# EAGLE design Adafruit PiTFT Plus 3.5in (EAGLE 6.6.0)
REV: C
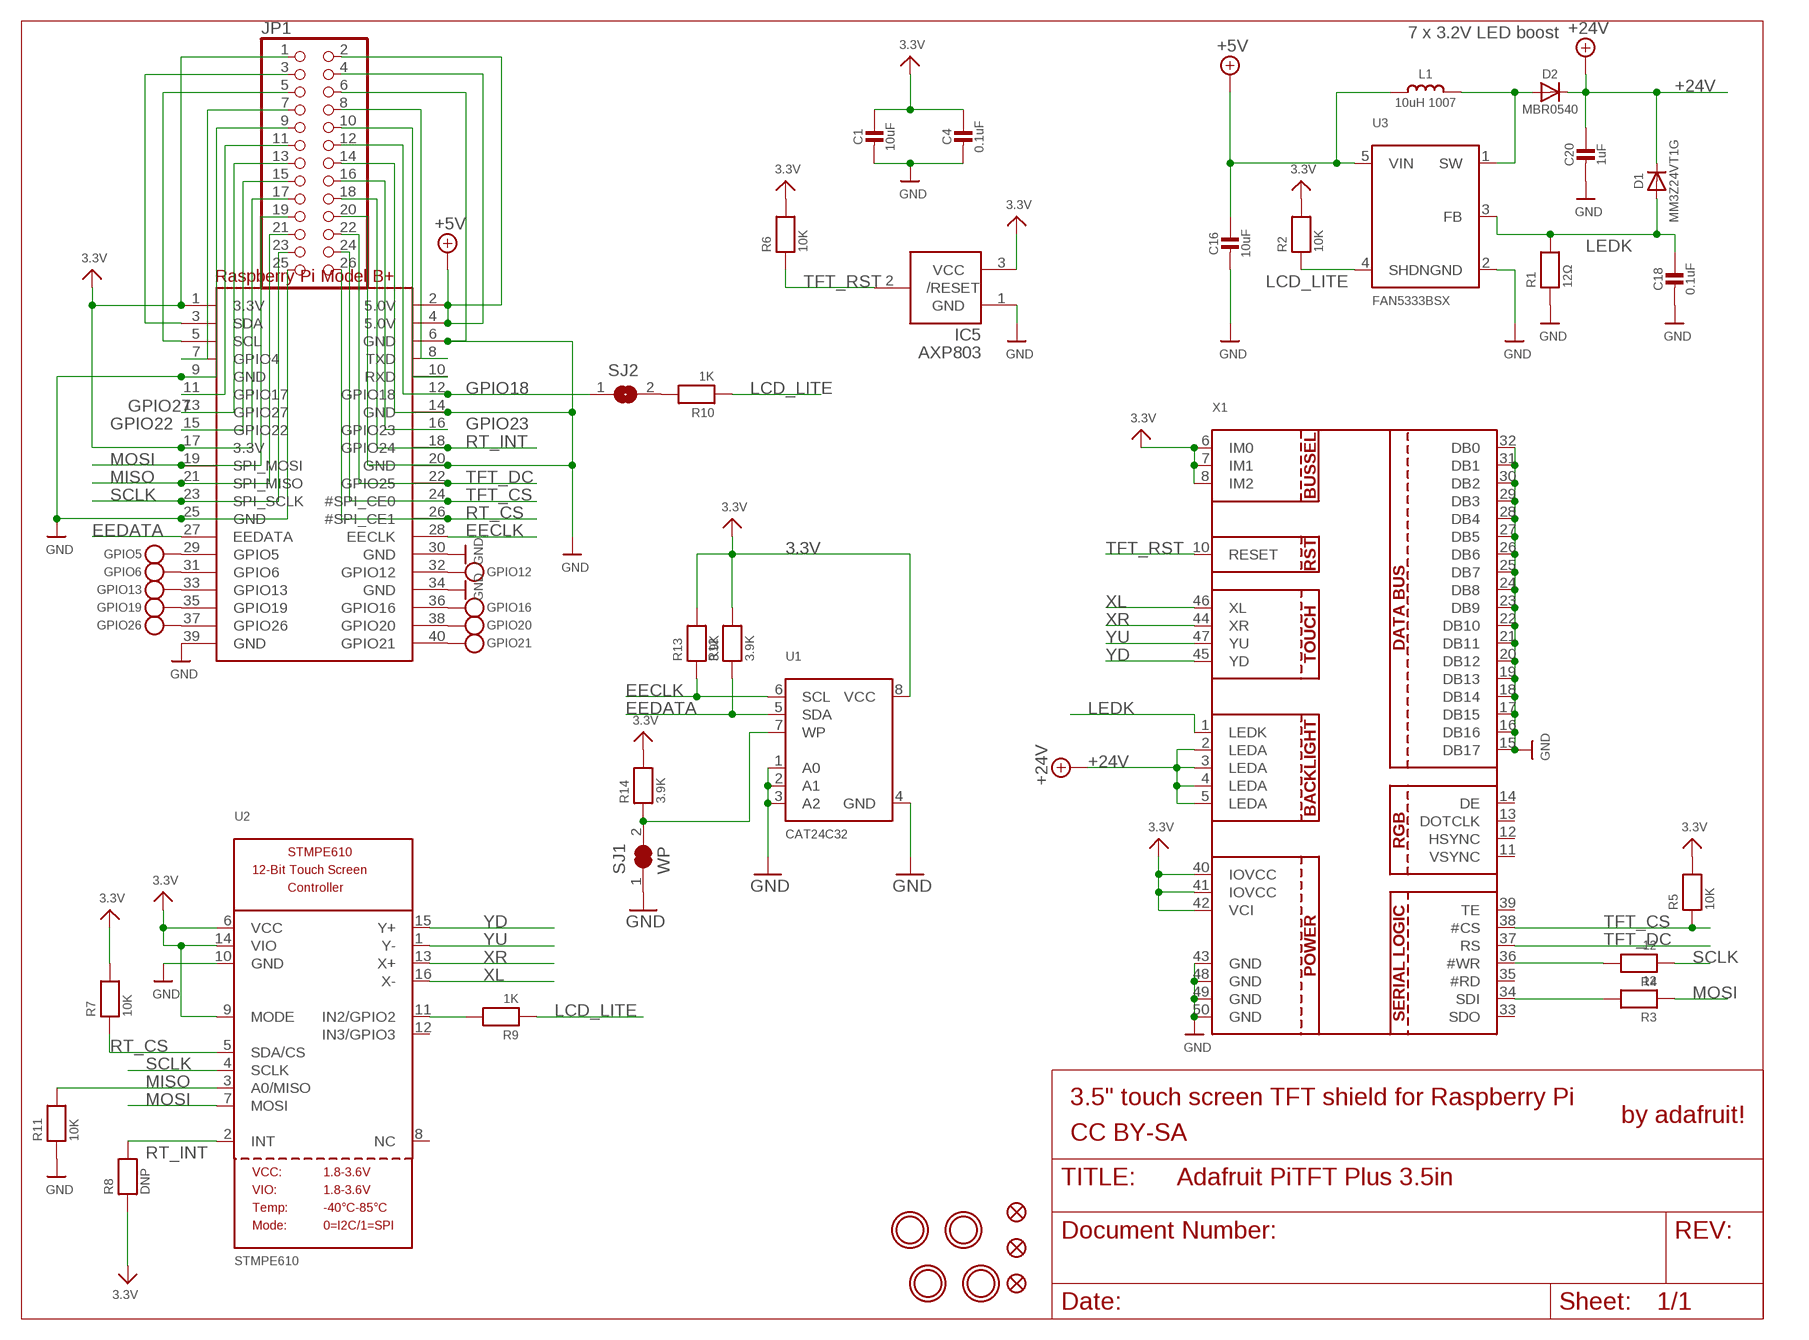
[diagram p0: schematic, sheet 1]

## Parts
C1  10uF  CAP_CERAMIC0805-NOOUTLINE  [0805-NO]
C4  0.1uF  CAP_CERAMIC0805-NOOUTLINE  [0805-NO]
C16  10uF  CAP_CERAMIC0805-NOOUTLINE  [0805-NO]
C18  0.1uF  CAP_CERAMIC0805-NOOUTLINE  [0805-NO]
C20  1uF  CAP_CERAMIC_0805MP  [_0805MP]
D1  MM3Z24VT1G  DIODESMA  [SMADIODE]
D2  MBR0540  DIODESOD-123  [SOD-123]
GPIO5  TESTPOINT1.5X2.0MM_NOCREAM  [PAD-1.5X2.0]
GPIO6  TESTPOINT1.5X2.0MM_NOCREAM  [PAD-1.5X2.0]
GPIO12  TESTPOINT1.5X2.0MM_NOCREAM  [PAD-1.5X2.0]
GPIO13  TESTPOINT1.5X2.0MM_NOCREAM  [PAD-1.5X2.0]
GPIO16  TESTPOINT1.5X2.0MM_NOCREAM  [PAD-1.5X2.0]
GPIO19  TESTPOINT1.5X2.0MM_NOCREAM  [PAD-1.5X2.0]
GPIO20  TESTPOINT1.5X2.0MM_NOCREAM  [PAD-1.5X2.0]
GPIO21  TESTPOINT1.5X2.0MM_NOCREAM  [PAD-1.5X2.0]
GPIO26  TESTPOINT1.5X2.0MM_NOCREAM  [PAD-1.5X2.0]
IC5  AXP803  AXP083-SAG  [SOT23]
JP1  HEADER-2X13-SMT  [2X13_SMT_MALE]
L1  10uH 1007  INDUCTOR  [INDUCTOR_1007]
R1  12Ω  RESISTOR0805_NOOUTLINE  [0805-NO]
R2  10K  RESISTOR0805_NOOUTLINE  [0805-NO]
R3  12  RESISTOR_0805MP  [_0805MP]
R4  12  RESISTOR0805_NOOUTLINE  [0805-NO]
R5  10K  RESISTOR0805_NOOUTLINE  [0805-NO]
R6  10K  RESISTOR0805_NOOUTLINE  [0805-NO]
R7  10K  RESISTOR0805_NOOUTLINE  [0805-NO]
R8  DNP  RESISTOR0805_NOOUTLINE  [0805-NO]
R9  1K  RESISTOR_0805MP  [_0805MP]
R10  1K  RESISTOR0805_NOOUTLINE  [0805-NO]
R11  10K  RESISTOR0805_NOOUTLINE  [0805-NO]
R12  3.9K  RESISTOR0805_NOOUTLINE  [0805-NO]
R13  3.9K  RESISTOR0805_NOOUTLINE  [0805-NO]
R14  3.9K  RESISTOR0805_NOOUTLINE  [0805-NO]
RPI1  RASPBERRYPI_BPLUS_SMT  [RASPBERRYPI_BPLUS_SHIELD_SMT]
SJ1  WP  SOLDERJUMPER_CLOSED  [SOLDERJUMPER_CLOSEDWIRE]
SJ2  SOLDERJUMPERCLOSED  [SOLDERJUMPER_CLOSEDWIRE]
U1  CAT24C32  EEPROM_I2C_SOIC8_GENERIC  [SOIC8_150MIL]
U2  STMPE610  [QFN16_3MM]
U3  FAN5333BSX  FAN5331  [SOT23-5@1]
U$10  FIDUCIAL""  [FIDUCIAL_1MM]
U$11  FIDUCIAL""  [FIDUCIAL_1MM]
U$15  MOUNTINGHOLE2.5_THICK  [MOUNTINGHOLE_2.5_PLATED_THICK]
U$16  MOUNTINGHOLE2.5_THICK  [MOUNTINGHOLE_2.5_PLATED_THICK]
U$17  MOUNTINGHOLE2.5_THICK  [MOUNTINGHOLE_2.5_PLATED_THICK]
U$18  FIDUCIAL""  [FIDUCIAL_1MM]
U$20  MOUNTINGHOLE2.5_THICK  [MOUNTINGHOLE_2.5_PLATED_THICK]
X1  DISP_LCD_3.5IN_320X480_50PIN  [TFT_3.5IN_320X480_50PIN]

## Nets
3.3V: C1.1 C4.1 IC5.3(VCC) JP1.1 JP1.17 R2.2 R5.2 R6.2 R7.2 R8.1 R12.2 R13.2 R14.2 RPI1.1(3.3V) RPI1.17(3.3V) U1.8(VCC) U2.6(VCC) U2.9(MODE) U2.14(VIO) X1.6(IM0) X1.7(IM1) X1.8(IM2) X1.40(IOVCC) X1.41(IOVCC) X1.42(VCI)
+5V: C16.1 JP1.2 JP1.4 L1.P$1 RPI1.2(5.0V) RPI1.4(5.0V) U3.5(VIN)
+24V: C20.1 D1.C D2.C X1.2(LEDA) X1.3(LEDA) X1.4(LEDA) X1.5(LEDA)
EECLK: R13.1 RPI1.28(EECLK) U1.6(SCL)
EEDATA: R12.1 RPI1.27(EEDATA) U1.5(SDA)
GND: C1.2 C4.2 C16.2 C18.2 C20.2 IC5.1(GND) JP1.6 JP1.9 JP1.14 JP1.20 JP1.25 R1.1 R11.1 RPI1.6(GND) RPI1.9(GND) RPI1.14(GND) RPI1.20(GND) RPI1.25(GND) RPI1.30(GND) RPI1.34(GND) RPI1.39(GND) SJ1.1 U1.1(A0) U1.2(A1) U1.3(A2) U1.4(GND) U2.10(GND) U3.2(GND) X1.15(DB17) X1.16(DB16) X1.17(DB15) X1.18(DB14) X1.19(DB13) X1.20(DB12) X1.21(DB11) X1.22(DB10) X1.23(DB9) X1.24(DB8) X1.25(DB7) X1.26(DB6) X1.27(DB5) X1.28(DB4) X1.29(DB3) X1.30(DB2) X1.31(DB1) X1.32(DB0) X1.43(GND) X1.48(GND) X1.49(GND) X1.50(GND)
GPIO6: GPIO6.P$1 RPI1.31(GPIO6)
GPIO16: GPIO16.P$1 RPI1.36(GPIO16)
GPIO18: JP1.12 RPI1.12(GPIO18) SJ2.1
GPIO22: JP1.15 RPI1.15(GPIO22)
GPIO23: JP1.16 RPI1.16(GPIO23)
GPIO27: JP1.13 RPI1.13(GPIO27)
LCD_LITE: R2.1 R9.1 R10.1 U3.4(SHDN)
LEDK: C18.1 D1.A R1.2 U3.3(FB) X1.1(LEDK)
MISO: JP1.21 R11.2 RPI1.21(SPI_MISO) U2.3(A0/MISO)
MOSI: JP1.19 R3.1 RPI1.19(SPI_MOSI) U2.7(MOSI)
N$1: R4.2 X1.36(#WR)
N$2: R3.2 X1.34(SDI)
N$3: R9.2 U2.11(IN2/GPIO2)
N$4: R10.2 SJ2.2
N$5: GPIO5.P$1 RPI1.29(GPIO5)
N$6: JP1.3 RPI1.3(SDA)
N$7: JP1.5 RPI1.5(SCL)
N$8: JP1.7 RPI1.7(GPIO4)
N$9: GPIO13.P$1 RPI1.33(GPIO13)
N$10: GPIO19.P$1 RPI1.35(GPIO19)
N$11: JP1.11 RPI1.11(GPIO17)
N$12: D2.A L1.P$2 U3.1(SW)
N$13: GPIO26.P$1 RPI1.37(GPIO26)
N$14: GPIO12.P$1 RPI1.32(GPIO12)
N$15: GPIO20.P$1 RPI1.38(GPIO20)
N$16: R14.1 SJ1.2 U1.7(WP)
N$17: JP1.10 RPI1.10(RXD)
N$18: JP1.8 RPI1.8(TXD)
N$19: GPIO21.P$1 RPI1.40(GPIO21)
RT_CS: JP1.26 R7.1 RPI1.26(#SPI_CE1) U2.5(SDA/CS)
RT_INT: JP1.18 R8.2 RPI1.18(GPIO24) U2.2(INT)
SCLK: JP1.23 R4.1 RPI1.23(SPI_SCLK) U2.4(SCLK)
TFT_CS: JP1.24 R5.1 RPI1.24(#SPI_CE0) X1.38(#CS)
TFT_DC: JP1.22 RPI1.22(GPIO25) X1.37(RS)
TFT_RST: IC5.2(/RESET) R6.1 X1.10(RESET)
XL: U2.16(X-) X1.46(XL)
XR: U2.13(X+) X1.44(XR)
YD: U2.15(Y+) X1.45(YD)
YU: U2.1(Y-) X1.47(YU)
Unconnected: U2.8(NC) U2.12(IN3/GPIO3) X1.11(VSYNC) X1.12(HSYNC) X1.13(DOTCLK) X1.14(DE) X1.33(SDO) X1.35(#RD) X1.39(TE)

## Notes on the sheet
- 7 x 3.2V LED boost
- 3.5" touch screen TFT shield for Raspberry Pi
- by adafruit!
- CC BY-SA

## Library data of the parts
C1 C4 C16 C18 C20 = microbuilder:CAP_CERAMIC: Ceramic Capacitors For new designs, use the packages preceded by an '_' character since they are more reliable: The following footprints should be used on most boards: _0402 - Standard footprint for regular board layouts _0603 - Standard footprint for regular board layouts _0805 - Standard footprint for regular board layouts _1206 - Standard footprint for regular board layouts For extremely tight-pitch boards where space is at a premium, the following 'micro-pitch' footprints can be used (smaller pads, no silkscreen outline, etc.): _0402MP - Micro-pitch footprint for very dense/compact boards _0603MP - Micro-pitch footprint for very dense/compact boards _0805MP - Micro-pitch footprint for very dense/compact boards _1206MP - Micro-pitch footprint for very dense/compact boards
D1 D2 = microbuilder:DIODE: Diode SMA Model Volts Amps Type Vf Ir Digikey # Notes SSA34-E3 40V 3A Schottky 480mV @ 3A 200uA @ 40V SSA34-E3/61TGITR-ND CDBA120-G 20V 1A Schottky 500mV @ 1A 500uA @ 20V 641-1014-6-ND REEL MBRA210 10V 2A Schottky 350mV @ 2A 700uA @ 10V MBRA210LT3 SOD-123 Model Volts Amps Type Vf Ir Order # Notes BAT54T1G 30V 200mA Schottky 800mV @ 200mA 2uA @ 25V BAT54T1GOSTR-ND B0530W 30V 500mA Schottky 430mV @ 500mA 130uA @ 30V B0530W-FDICT-ND REEL MBR120 20V 1A Schottky 340mV @ 1A MBR120VLSFT1GOSCT-ND SOD-323 Model Volts Amps Type Vf Ir Order # Notes PMEG2005EJ 20V 500mA Schottky 355mV @ 500mA 568-4110-1-ND ZLLS410 10V 570mA Schottky 380mV @ 570mA ZLLS410CT-ND 1N4148WS 75V 150mA Silicon/Simple 1V 1N4148WSFSCT-ND REEL SOD-523 Model Volts Amps Type Vf Ir Order # Notes BAT54XV2 30V 200mA Schottky 0.8V @ 100mA BAT54XV2CT-ND TB751S 30V 30mA Schottky RB751S-40TE61CT-ND SOT23-R/W (R = Solder Paste/Reflow Ovens, W = Hand-Soldering) Model Volts Amps Type Vf Ir Order # Notes BAT54FILM 40V 300mA Schottky 497-7162-1-ND POWERDI-5 Model Volts Amps Type Vf Ir Order # Notes PDS560 60V 5A Schottky 670mV @ 5A 150uA @ 60V PDS560DICT-ND
GPIO5 GPIO6 GPIO12 GPIO13 GPIO16 GPIO19-GPIO21 GPIO26 = microbuilder:TESTPOINT: Test Point Various test points for characterisation and PCB testing TESTPOINT_SMT - Compact Surface Mount Test Point [Digikey: 5016KTR-ND]
IC5 = adafruit:AXP083
JP1 = microbuilder:HEADER-2X13
L1 = microbuilder:INDUCTOR: Inductors 0603: 10nH Ceramic Inductor - microwire antenna/RF (Digikey: 712-1434-2-ND) 0805: 560nH Ceramic Inductor - RF (Digikey: 553-1047-1-ND) 270nH Ceramic Inductor - Q = 40@250MHz, +-5%, 1 Ohm DC Resistance (Digikey: 535-10506-2-ND) 1007 (2518 Metric) SMT: 10µH 10% 250mOhm 820mA 1007 Inductor (Digikey: 587-2189-1-ND) 22µH 10% 500mOhm 580mA 1007 Inductor (Digikey: 587-2190-1-ND) 47µH 10% 950mOhm 420mA 1007 Inductor (Digikey: 587-2191-1-ND) 47µH 5% 100mOhm 1A 1008 Inductor (Digikey: 732-1816-1-ND) 5.0x5.0mm (Taiyo Yuden NR5040 Series) 6.8µH 20% 2.3A 64mOhm Inductor (Digikey: 587-2374-2-ND) 5.0x5.0mm (TDK VLC5045 Series) 4.7µH 20% 3.3A 34mOhm Inductor (Digikey: 445-6526-1-ND) 6.8µH 20% 2.7A 46mOhm Inductor (Digikey: 445-6527-1-ND) 6.0x6.0mm (TDK VLC6045 Series) 4.7µH 20% 3.8A 27mOhm Inductor (Digikey: 445-6538-2-ND) 6.8µH 20% 3A 41mOhm Inductor (Digikey: 445-6540-1-ND) 6.2µH 30% 2.2A 45mOhm Inductor (Digikey: SRR5028-6R2YCT-ND) - Not TDK VLC6045 but footprint should match 6.0x6.0mm (TDK SLF6045 Series) 6.8uH 30% 2A 33mOhm Inductor (Digikey: 445-4572-1-ND, Mouser: 810-SLF645T6R8N2R0PF) 6.0x6.0mm (Sumida CDRH5D28 Series) 6.2uH 30% 1.8A 45mOhm Inductor (Digikey: 308-1542-1-ND) Taiyo Yuden NR3015T2R2M - 2.2uH 20% 1.5A (Digikey: 587-1648-2-ND, Mouser: 963-NR3015T2R2M) - Used with TI TPS62172 CoilCraft RFID Transponder Coil - MA5532-AE (For use with AS3935 Lightning Sensor) Vishay IHLP 1.0uH Molded Inductor - 24mOhm DCR, 5A, +/-20%, -55°C-125°C (Digikey: 541-1319-1-ND)
R1-R14 = microbuilder:RESISTOR: Resistors For new designs, use the packages preceded by an '_' character since they are more reliable: The following footprints should be used on most boards: _0402 - Standard footprint for regular board layouts _0603 - Standard footprint for regular board layouts _0805 - Standard footprint for regular board layouts For extremely tight-pitch boards where space is at a premium, the following 'micro-pitch' footprints can be used (smaller pads, no silkscreen outline, etc.): _0402MP - Micro-pitch footprint for very dense/compact boards _0603MP - Micro-pitch footprint for very dense/compact boards _0805MP - Micro-pitch footprint for very dense/compact boards
RPI1 = microbuilder:RASPBERRYPI_BPLUS
SJ1 = microbuilder:SOLDERJUMPER_CLOSED: Solder Jumper - Closed These solder jumpers are closed by default CLOSEDWIRE - 10 mil trace between pads that can be cut and resoldered later CLOSEDPERM - 63 mil trace between pads for a permanent connection (used to 'bridge' two signals, a shameless hack for Eagle). Can double as a test point as well (no cream layer)
SJ2 = microbuilder:SOLDERJUMPER: SMD Solder JUMPER Solder the two pads together to create a connection, or remove the solder to break it. REFLOW - Use this footprint for solder paste and reflow ovens. WAVE - Use this footprint for hand-soldering (larger pads). CLOSED - Has a trace between the two pads to ensure it is closed by default. The trace needs to be cut to disable the jumper, and can be closed again by creating a solder bridge between the two pads.
U1 = microbuilder:EEPROM_I2C_SOIC8_GENERIC: Note: The same pinout is used for many I2C EEPROMs in SOIC8(150mil) from a variety of manufacturers and in various sizes. Examples: 16K (2K x 8 Bit) I2C EEPROM 1.7-5.5V, 400KHz, -40°C-85°C Digikey: CAT24C16WI-GT3CT-ND 256K (32K x 8 Bit) I2C EEPROM 1.7-5.5V, 400KHz, -40°C-85°C Digikey: 24AA256-I/SN-ND
U2 = microbuilder:STMPE610: STMPE610 - 12-Bit Touch Screen Controller
U3 = microbuilder:FAN5331: FAN5331 - LED/OLED 20V Boost Converter Digikey: FAN5331SXCT-ND
U$10 U$11 U$18 = microbuilder:FIDUCIAL: Fiducial Alignment Points Various fiducial points for machine vision alignment.; BOM: EXCLUDE
U$15-U$17 U$20 = microbuilder:MOUNTINGHOLE: Mounting Hole For #2 screws (0.086"/2.18mm width, 0.094"/2.4mm hole) use 2.5mm; BOM: EXCLUDE
X1 = microbuilder:DISP_LCD_3.5IN_320X480_50PIN: DT350HV15-T - 3.5" 320x480 TFT Display, 50 Pin Connector

## Board
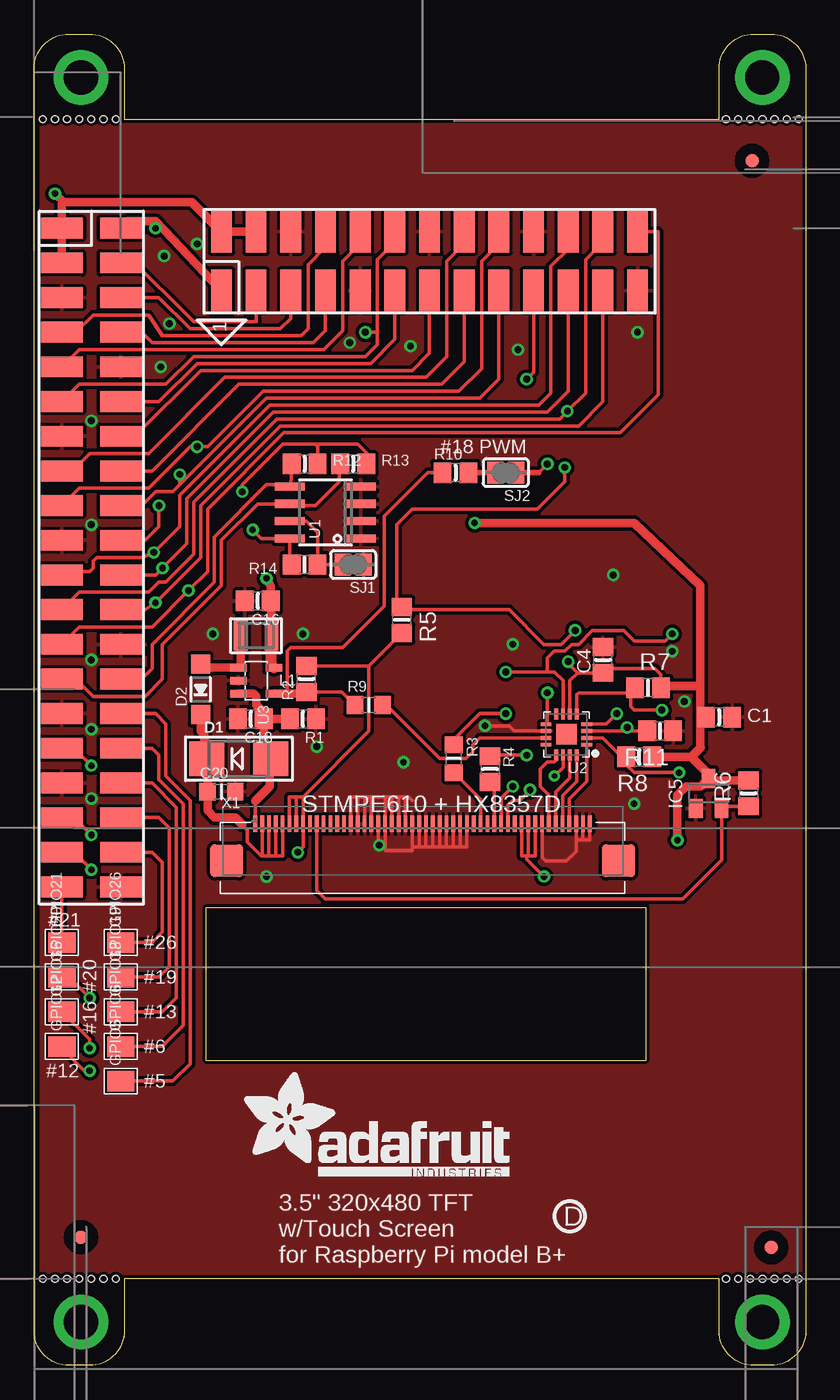
[diagram p1: board, top side]
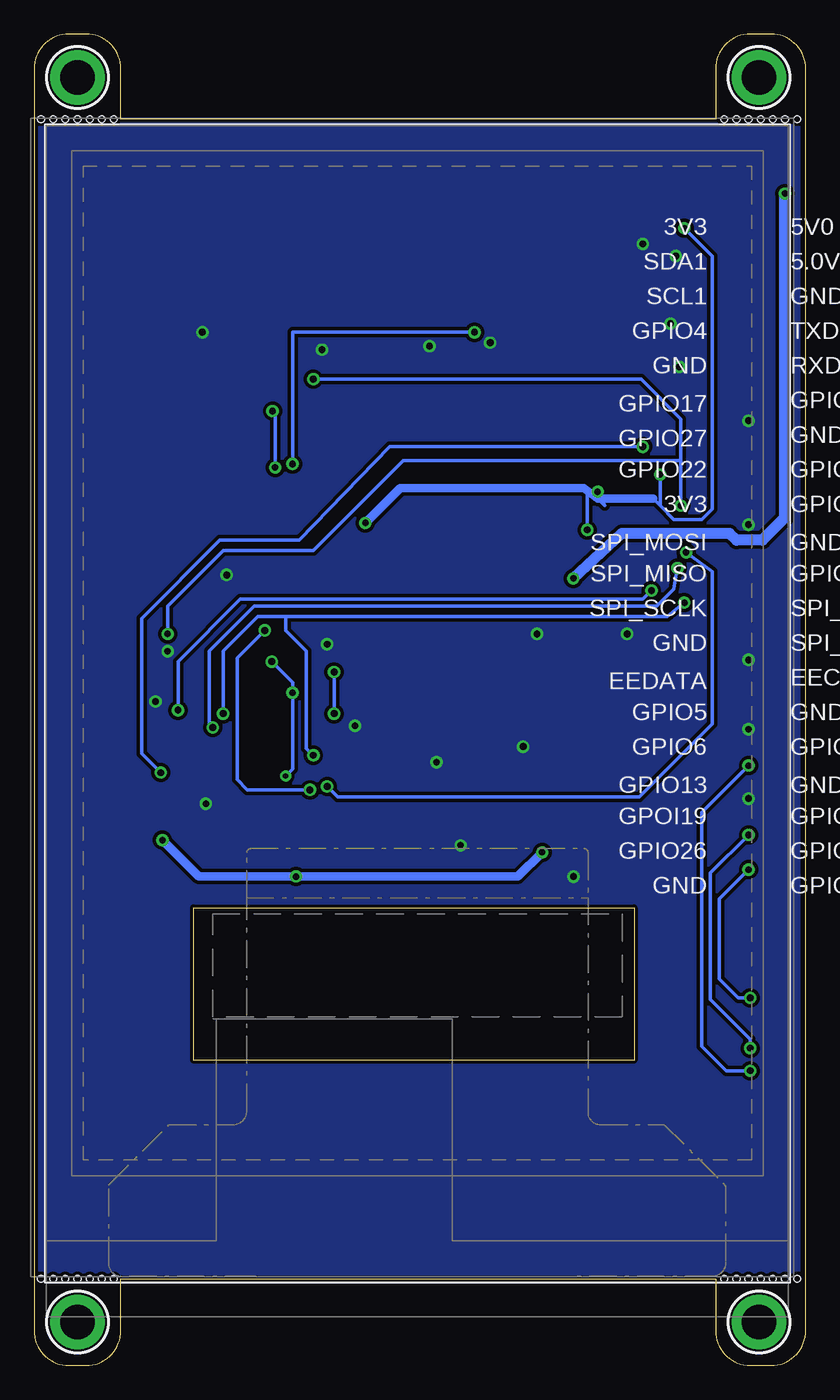
[diagram p2: board, bottom side, seen from below]

Size 56.52 x 97.54 mm. Coordinates in mm from the lower left corner, seen from the top.
Outline: 44.83,33.53 12.57,33.53 12.57,22.35 44.83,22.35 44.83,33.53
Outline: 6.6,6.35 6.6,2.54 arc-90 4.06,0 2.54,0 arc-90 0,2.54 0,95 arc-90 2.54,97.54 4.06,97.54 arc-90 6.6,95 6.6,91.31 50.16,91.31 50.16,95 arc-90 52.7,97.54 53.98,97.54 arc-90 56.52,95 56.52,2.54 arc-90 53.98,0 52.7,0 arc-90 50.16,2.54 50.16,6.35 6.6,6.35
Copper layers (1*16): Top 0.035mm / dielectric 1.5mm / Bottom 0.035mm
Design rules "adafruit": minimum track width 8mil, minimum drill 15.5mil, track to track 8mil, track to pad 8mil, pad to pad 8mil, via to via 8mil, smd to smd 8mil, copper to edge 10mil, drill to drill 8mil, minimum pad ring 10mil, minimum via ring 8mil, stop-mask expansion 2mil, vias tented up to drill 20mil, thermal gap 10mil
Holes 0.5 mm at 5.97,91.31 5.08,91.31 4.19,91.31 3.3,91.31 2.41,91.31 1.52,91.31 0.64,91.31 56.01,91.31 55.12,91.31 54.23,91.31 53.34,91.31 52.45,91.31 51.56,91.31 50.67,91.31 5.97,6.35 5.08,6.35 4.19,6.35 3.3,6.35 2.41,6.35 1.52,6.35 0.64,6.35 56.01,6.35 55.12,6.35 54.23,6.35 53.34,6.35 52.45,6.35 51.56,6.35 50.67,6.35
tKeepout: area 23.9,39.5 to 24,39.9
tRestrict: area 23.4,39.5 to 23.5,39.9; area 24.4,39.5 to 24.5,39.9; area 24.9,39.5 to 25,39.9; area 25.4,39.5 to 25.5,39.9; area 25.9,39.5 to 26,39.9; area 26.4,39.5 to 26.5,39.9; area 26.9,39.5 to 27.1,39.9; area 27.4,39.5 to 27.5,39.9; area 27.9,39.5 to 28,39.9; area 28.4,39.5 to 28.5,39.9; area 28.9,39.5 to 29,39.9; area 29.4,39.5 to 29.5,39.9; 7 more areas

### Footprints (pad centres in the part's own frame; a part is rotated, then mirrored left to right if it is on the bottom)
0805-NO = smd 1.3 x 1.5: 1 -0.95,0; 2 0.95,0
_0805MP = smd 1.2 x 1.3: 1 -1.016,0; 2 1.016,0
SMADIODE = smd 2.54 x 2.54: A 2.349,0; C -2.349,0
SOD-123 = smd 1.4 x 1.4: A 1.85,0; C -1.85,0
PAD-1.5X2.0 = smd 1.5 x 2: P$1 0,0
SOT23 = smd 1 x 1.4: 1 -0.95,-1.1; 2 0.95,-1.1; 3 0,1.1
2X13_SMT_MALE = smd 1.524 x 3.048: 1 -15.24,-2.159; 2 -15.24,2.159; 3 -12.7,-2.159; 4 -12.7,2.159; 5 -10.16,-2.159; 6 -10.16,2.159; 7 -7.62,-2.159; 8 -7.62,2.159; 9 -5.08,-2.159; 10 -5.08,2.159; 11 -2.54,-2.159; 12 -2.54,2.159; 13 0,-2.159; 14 0,2.159; 15 2.54,-2.159; 16 2.54,2.159; 17 5.08,-2.159; 18 5.08,2.159; 19 7.62,-2.159; 20 7.62,2.159; 21 10.16,-2.159; 22 10.16,2.159; 23 12.7,-2.159; 24 12.7,2.159; 25 15.24,-2.159; 26 15.24,2.159
INDUCTOR_1007 = smd 1.016 x 2.2: P$1 -1.127,0; P$2 1.127,0
RASPBERRYPI_BPLUS_SHIELD_SMT = smd 3.048 x 1.524 bottom: 1 50.419,76.835; 2 54.737,76.835; 3 50.419,74.295; 4 54.737,74.295; 5 50.419,71.755; 6 54.737,71.755; 7 50.419,69.215; 8 54.737,69.215; 9 50.419,66.675; 10 54.737,66.675; 11 50.419,64.135; 12 54.737,64.135; 13 50.419,61.595; 14 54.737,61.595; 15 50.419,59.055; 16 54.737,59.055; 17 50.419,56.515; 18 54.737,56.515; 19 50.419,53.975; 20 54.737,53.975; 21 50.419,51.435; 22 54.737,51.435; 23 50.419,48.895; 24 54.737,48.895; 25 50.419,46.355; 26 54.737,46.355; 27 50.419,43.815; 28 54.737,43.815; 29 50.419,41.275; 30 54.737,41.275; 31 50.419,38.735; 32 54.737,38.735; 33 50.419,36.195; 34 54.737,36.195; 35 50.419,33.655; 36 54.737,33.655; 37 50.419,31.115; 38 54.737,31.115; 39 50.419,28.575; 40 54.737,28.575
SOLDERJUMPER_CLOSEDWIRE = smd 1.168 x 1.6: 1 -0.762,0; 2 0.762,0 | smd 0.635 x 0.203: WIRE 0,0
SOIC8_150MIL = smd 0.6 x 2.2: 1 -1.905,-2.6; 2 -0.635,-2.6; 3 0.635,-2.6; 4 1.905,-2.6; 5 1.905,2.6; 6 0.635,2.6; 7 -0.635,2.6; 8 -1.905,2.6
QFN16_3MM = smd 0.8 x 0.28: 1 -1.5,0.75; 2 -1.5,0.25; 3 -1.5,-0.25; 4 -1.5,-0.75; 9 1.5,-0.75; 10 1.5,-0.25; 11 1.5,0.25; 12 1.5,0.75 | smd 0.28 x 0.8: 5 -0.75,-1.5; 6 -0.25,-1.5; 7 0.25,-1.5; 8 0.75,-1.5; 13 0.75,1.5; 14 0.25,1.5; 15 -0.25,1.5; 16 -0.75,1.5 | smd 1.5 x 1.5: THERMAL 0,0
SOT23-5@1 = smd 0.55 x 1.2: 1 -0.95,-1.3; 2 0,-1.3; 3 0.95,-1.3; 4 0.95,1.3; 5 -0.95,1.3
FIDUCIAL_1MM = smd 1 x 1: 1 0,0
MOUNTINGHOLE_2.5_PLATED_THICK = drill 2.5 pad 4: P$1 0,0
TFT_3.5IN_320X480_50PIN = smd 0.275 x 1.2 bottom: 1 12.25,-3.76; 2 11.75,-3.76; 3 11.25,-3.76; 4 10.75,-3.76; 5 10.25,-3.76; 6 9.75,-3.76; 7 9.25,-3.76; 8 8.75,-3.76; 9 8.25,-3.76; 10 7.75,-3.76; 11 7.25,-3.76; 12 6.75,-3.76; 13 6.25,-3.76; 14 5.75,-3.76; 15 5.25,-3.76; 16 4.75,-3.76; 17 4.25,-3.76; 18 3.75,-3.76; 19 3.25,-3.76; 20 2.75,-3.76; 21 2.25,-3.76; 22 1.75,-3.76; 23 1.25,-3.76; 24 0.75,-3.76; 25 0.25,-3.76; 26 -0.25,-3.76; 27 -0.75,-3.76; 28 -1.25,-3.76; 29 -1.75,-3.76; 30 -2.25,-3.76; 31 -2.75,-3.76; 32 -3.25,-3.76; 33 -3.75,-3.76; 34 -4.25,-3.76; 35 -4.75,-3.76; 36 -5.25,-3.76; 37 -5.75,-3.76; 38 -6.25,-3.76; 39 -6.75,-3.76; 40 -7.25,-3.76; 41 -7.75,-3.76; 42 -8.25,-3.76; 43 -8.75,-3.76; 44 -9.25,-3.76; 45 -9.75,-3.76; 46 -10.25,-3.76; 47 -10.75,-3.76; 48 -11.25,-3.76; 49 -11.75,-3.76; 50 -12.25,-3.76 | smd 2.4 x 2.4 bottom: PAD1 14.35,-6.46; PAD2 -14.35,-6.46

### Placement (x,y rotation side)
C1  50.16,47.5 0 top
C4  41.66,51.69 90 top
C16  16.38,56.01 180 top
C18  15.88,47.37 180 top
C20  13.72,42.04 0 top
D1  14.99,44.45 0 top
D2  12.19,49.53 90 top
GPIO5  6.35,20.83 90 top
GPIO6  6.35,23.37 90 top
GPIO12  2.03,23.37 90 top
GPIO13  6.35,25.91 90 top
GPIO16  2.03,25.91 90 top
GPIO19  6.35,28.45 90 top
GPIO20  2.03,28.45 90 top
GPIO21  2.03,30.99 90 top
GPIO26  6.35,30.99 90 top
IC5  49.4,41.91 0 top
JP1  28.96,80.9 0 top
L1  16.26,53.47 180 top
R1  19.68,47.37 180 top
R2  19.94,50.29 90 top
R3  30.73,44.45 270 top
R4  33.4,43.69 270 top
R5  26.92,54.61 270 top
R6  52.32,41.91 90 top
R7  44.96,49.66 0 top
R8  44.32,44.58 180 top
R9  24.51,48.39 0 top
R10  30.86,65.41 0 top
R11  45.85,46.48 180 top
R12  19.81,66.04 0 top
R13  23.37,66.04 0 top
R14  19.81,58.67 180 top
RPI1  56.77,6.48 0 bottom
SJ1  23.37,58.67 180 top
SJ2  34.54,65.41 180 top
U1  21.34,62.48 90 top
U2  38.99,46.23 180 top
U3  16.26,50.16 270 top
U$10  53.98,8.64 90 top
U$11  3.43,9.4 180 top
U$15  3.43,3.17 90 bottom
U$16  53.34,94.36 90 bottom
U$17  53.34,3.17 0 bottom
U$18  52.58,88.27 0 top
U$19  [PCBFEAT-REV-056]  39.24,10.92 0 top
U$20  3.43,94.36 0 bottom
U$23  [ADAFRUIT_TEXT_20MM]  15.24,13.84 0 top
X1  28.45,43.43 0 bottom

### Tracks (layer width: path | path; a pad name or v marks a point on that pad's centre or on a via)
3.3V  (via drill 0.39, 0.48, 0.5)
  Top 0.254: 45.97,49.72 R7.2 45.91,50.61 45.47,51.05 41.97,51.05 C4.1 39.82,50.74 | 39.82,50.74 39.24,50.16 U2.6 | 37.49,49.17 v37.59,49.28 37.59,47.08 U2.9 | v39.12,51.56 39.12,51.44 39.82,50.74 | IC5.3 49.55,42.86 | 35.7,38.86 X1.40 35.7,37.34 36.07,37.34 | 36.7,38.98 X1.42 36.7,38.67 36.7,37.34 36.2,37.34 | 36.07,37.34 36.2,37.34 | X1.41 36.2,37.34 | v37.34,35.81 36.07,37.08 36.07,37.34 | 10.67,64.52 10.16,64.01 8.89,64.01 7.87,62.99 RPI1.17 | 10.67,64.52 17.02,70.87 32.64,70.87 34.04,72.26 JP1.17 | 13.34,78.74 JP1.1 | X1.6 18.7,41.66 19.2,41.66 | 19.7,41.66 X1.8 19.7,37.99 v19.3,37.59 | 19.7,41.66 19.2,41.66 | X1.7 19.2,41.66 | C1.1 48.77,47.5 | U2.14 38.74,43.82 v38.1,43.18 | R5.2 24.51,51.24 | 24.51,51.24 R2.2 | 19.7,41.66 24.51,46.46 24.51,51.24 | 10.67,64.52 v10.67,65.28 | v8.89,83.31 8.89,83.82 | R14.2 18.74,59.05 U1.8 16.64,60.58 v16,61.21 | v15.24,64.01 15.24,64.52 18.22,67.5 20.57,67.5 | 20.57,67.5 23.69,67.5 24.38,66.8 24.38,66.11 R13.2 | R12.2 20.76,67.31 20.57,67.5
  Top 0.61: 48.77,49.78 48.77,57.15 43.94,61.72 v32.26,61.72 | 48.77,49.78 48.77,47.5 48.77,45.34 48.83,45.27 48.13,44.58 | v47.12,38.48 47.12,41.78 47.75,42.42 48.81,42.42 IC5.3 49.4,43.31 48.13,44.58 | 49.55,42.86 R6.2 | R8.1 48.13,44.58 | R7.2 46.03,49.78 48.77,49.78 | RPI1.1 6.86,83.82 8.89,83.82 JP1.1
  Bottom 0.254: v39.12,51.56 37.59,50.04 v37.59,49.28 37.59,43.69 v38.1,43.18 | v10.67,65.28 10.67,62.99 | 11.18,63.5 10.67,62.99 | 10.67,62.99 9.65,61.98 7.62,61.98 6.86,62.74 6.86,81.28 v8.89,83.31 | 15.24,63.5 14.73,62.99 v15.24,64.01 | v16,61.21 16,64.01 16.26,64.26
  Bottom 0.61: v47.12,38.48 44.45,35.81 v37.34,35.81 21.08,35.81 v19.3,37.59 | v32.26,61.72 29.72,64.26 16.26,64.26 15.24,63.5 11.18,63.5
+5V  (via drill 0.48)
  Top 0.61: L1.P$1 17.38,55.96 C16.1 17.33,57.09 v17.02,57.66 | RPI1.4 RPI1.2 2.03,85.09 2.16,85.22 | 2.16,85.22 11.56,85.22 JP1.2 JP1.4 | v1.52,85.85 2.16,85.22
  Top 0.813: U3.5 17.38,51.29 L1.P$1
  Bottom 0.813: v1.52,85.85 1.52,62.1 3.17,60.45 5.08,60.45 5.59,60.96 13.46,60.96 v17.02,57.66
+24V
  Top 0.254: X1.5 18.2,37.34 17.7,37.34 | 17.7,37.34 17.2,37.34 | 17.2,37.34 16.7,37.34 | 16.7,37.34 X1.2 | X1.3 17.2,37.34 | X1.4 17.7,37.34 | 15.24,39.62 15.62,39.24 15.62,38.35 16.64,37.34 16.7,37.34
  Top 0.61: 15.24,39.62 14.73,40.13 13.21,40.13 12.7,40.64 C20.1 12.7,44.39 D1.C 12.45,44.64 12.45,46.23 12.19,46.48 D2.C
EECLK
  Top 0.254: RPI1.28 3.05,50.29 4.32,49.02 8.13,49.02 9.4,50.29 9.4,52.83 13.72,57.15 13.72,60.45 16.38,63.12 U1.6 18.86,62.99 20.57,62.99 22.35,64.77 22.35,66.04 R13.1
EEDATA
  Top 0.254: RPI1.27 7.87,50.29 8.64,51.05 8.64,52.83 13.21,57.4 13.21,60.71 17.02,64.52 18.54,64.52 U1.5 | 18.61,64.26 U1.5 | R12.1 18.8,64.45 U1.5
GND  (via drill 0.48, 0.5)
  Top 0.254: 34.8,53.09 v35.05,52.83 | U2.10 35.17,46.48 34.79,46.86 v33.02,46.86 | X1.43 37.2,37.22 37.47,36.96 38.99,36.96 39.7,37.67 39.7,38.48 | X1.48 39.7,38.48 | 23.62,41.66 23.37,41.66 23.2,41.49 X1.15 23.2,41.66 | 23.62,41.66 24.13,41.66 | 24.13,41.66 24.64,41.66 | 24.64,41.66 25.15,41.66 | 25.15,41.66 25.65,41.66 | 25.65,41.66 26.16,41.66 | 26.16,41.66 26.67,41.66 | 26.67,41.66 27.18,41.66 | 27.18,41.66 27.43,41.66 27.7,41.39 | X1.23 27.2,41.64 27.18,41.66 | X1.22 26.7,41.63 26.67,41.66 | X1.21 26.2,41.62 26.16,41.66 | 25.65,41.66 25.7,41.61 X1.20 25.7,37.72 27.7,37.72 27.7,37.97 | 25.2,41.6 25.15,41.66 | X1.18 24.7,41.6 24.64,41.66 | X1.17 24.2,41.59 24.13,41.66 | X1.16 23.7,41.58 23.62,41.66 | X1.19 25.2,38.17 v25.27,38.1 | X1.24 27.7,37.97 | X1.25 28.2,37.97 | 28.2,37.97 27.7,37.97 | X1.27 29.2,37.97 | 29.2,37.97 28.7,37.97 | 28.7,37.97 28.2,37.97 | X1.28 29.7,37.97 | 29.7,37.97 29.2,37.97 | X1.26 28.7,37.97 | X1.29 30.2,37.97 | 30.2,37.97 29.7,37.97 | X1.30 30.7,37.97 | 30.7,37.97 30.2,37.97 | X1.31 31.2,37.97 | 31.2,37.97 30.7,37.97 | X1.32 31.7,37.97 31.2,37.97 | X1.49 40.2,38.48 | 40.2,38.48 39.7,38.48 | X1.50 40.7,38.48 40.2,38.48
  other vias: 46.74,52.32 42.42,57.91 43.94,41.15 20.7,45.34 17.02,35.81 19.68,53.59 4.19,69.22 9.91,76.33 9.27,73.15 9.53,81.28 11.94,82.17 23.11,74.93 27.56,74.68 35.43,74.42 44.2,75.69 27.05,44.2 47.62,48.64 4.19,61.59 4.19,51.69 4.19,46.61 4.19,41.53 13.08,53.59
  pour Top (isolate 0.254): 0.51,6.35 0.51,91.44 56.39,91.44 56.39,6.35
  pour Bottom (isolate 0.254): 0.51,6.35 0.51,91.44 56.39,91.44 56.39,6.35
GPIO6
  Top 0.254: GPIO6.P$1 9.4,23.37 10.92,24.89 10.92,41.15 9.14,42.93 9.14,44.7 8.64,45.21 RPI1.31
GPIO16  (via drill 0.48)
  Top 0.254: RPI1.36 2.92,40.13 v4.19,38.86 | GPIO16.P$1 4.06,23.88 v4.06,23.24
  Bottom 0.254: v4.19,38.86 6.99,36.07 6.99,26.8 4.06,23.88 v4.06,23.24
GPIO18  (via drill 0.5)
  Top 0.254: JP1.12 26.42,82.3 25.15,81.03 25.15,75.69 | 25.15,75.69 25.15,74.8 24.26,73.91 11.68,73.91 9.65,71.88 3.3,71.88 RPI1.12 | 36.96,65.41 v37.59,66.04 | v24.26,75.69 25.15,75.69
  Top 0.406: 36.96,65.41 SJ2.1
  Bottom 0.254: v37.59,66.04 37.59,75.69 v24.26,75.69
GPIO22
  Top 0.254: JP1.15 31.5,73.53 29.84,71.88 14.99,71.88 8.64,65.53 RPI1.15
GPIO23
  Top 0.254: JP1.16 31.24,82.8 31.24,81.91 30.23,80.9 30.23,73.91 28.7,72.39 13.97,72.39 8.38,66.8 4.06,66.8 2.54,65.28 2.29,65.28 RPI1.16
GPIO27
  Top 0.254: JP1.13 28.96,74.17 27.69,72.9 12.19,72.9 7.37,68.07 RPI1.13
LCD_LITE
  Top 0.254: 18.67,49.22 18.8,49.22 | R2.1 22.54,49.34 R9.1 | R10.1 28.83,65.41 25.65,62.23 25.65,55.63 22.61,52.58 18.8,52.58 18.54,52.32 18.54,49.22
  Top 0.61: U3.4 18.54,49.22 18.8,49.22 19.81,49.22 R2.1
LEDK
  Top 0.254: X1.1 16.2,41.34
  Top 0.61: C18.1 R1.2 | U3.3 16.06,49.22 16.26,49.02 16.26,48.39 16.76,47.88 16.76,47.43 C18.1 | 16.2,41.34 17.27,42.42 17.27,44.39 D1.A 16.82,44.96 C18.1
MISO  (via drill 0.48, 0.5)
  Top 0.254: U2.3 43.18,46.48 v43.43,46.74 43.69,46.48 R11.2 | JP1.21 39.12,71.37 37.59,69.85 17.53,69.85 11.18,63.5 11.18,60.2 v9.4,58.42 8.89,57.91 RPI1.21
  Bottom 0.254: v43.43,46.74 43.69,46.99 43.69,52.32 40.39,55.63 10.92,55.63 9.65,56.9 v9.4,58.42
MOSI  (via drill 0.48, 0.5)
  Top 0.254: v34.54,50.8 37.59,50.8 | 37.59,50.8 38.1,50.8 38.74,50.16 U2.7 | v46.74,53.59 46.23,53.09 43.94,53.09 43.18,53.85 40.89,53.85 39.88,52.83 39.37,52.83 38.86,52.32 38.1,52.32 37.59,51.82 37.59,50.8 | JP1.19 36.58,72.77 v36.07,72.26 | v34.54,47.75 32.64,47.75 30.73,45.85 R3.1 | RPI1.19 8.13,60.45 9.14,61.47 v9.14,62.99
  Bottom 0.254: v34.54,47.75 v34.54,50.8 | v46.74,53.59 46.74,55.63 42.67,59.69 36.07,59.69 29.46,66.29 9.14,66.29 | v36.07,72.26 12.06,72.26 9.14,69.34 9.14,66.29 | 9.14,66.29 v9.14,62.99
N$1
  Top 0.254: X1.36 33.7,42.44 R4.2
N$2
  Top 0.254: X1.34 32.7,41.47 R3.2
N$3
  Top 0.254: U2.11 32.64,45.98 32.13,45.47 32.13,44.96 31.62,44.45 29.72,44.45 25.78,48.39 R9.2
N$4
  Top 0.406: SJ2.2 R10.2
N$5
  Top 0.254: GPIO5.P$1 10.16,20.83 11.43,22.1 11.43,41.4 9.65,43.18 9.65,46.99 8.89,47.75 RPI1.29
N$6
  Top 0.254: JP1.3 16.26,76.45 11.68,76.45 6.86,81.28 RPI1.3
N$7
  Top 0.254: JP1.5 18.8,76.71 18.03,75.95 11.43,75.95 9.14,78.23 RPI1.5
N$8
  Top 0.254: JP1.7 21.34,75.82 20.45,74.93 8.64,74.93 7.87,75.69 RPI1.7
N$9
  Top 0.254: GPIO13.P$1 9.4,25.91 10.41,26.92 10.41,40.89 8.64,42.67 RPI1.33
N$10
  Top 0.254: GPIO19.P$1 9.14,28.45 9.91,29.21 9.91,39.37 9.14,40.13 RPI1.35
N$11
  Top 0.254: JP1.11 26.42,75.18 24.64,73.41 11.94,73.41 9.14,70.61 RPI1.11
N$12
  Top 0.61: D2.A 12.46,51.12 U3.1 15.13,51.29 L1.P$2
N$13
  Top 0.254: GPIO26.P$1 8.64,30.99 9.4,31.75 9.4,36.83 8.64,37.59 RPI1.37
N$14  (via drill 0.48)
  Top 0.254: RPI1.32 2.92,45.21 v4.19,43.94 | GPIO12.P$1 2.16,23.11 3.68,21.59 v4.06,21.59
  Bottom 0.254: v4.19,43.94 7.62,40.51 7.62,23.37 5.84,21.59 v4.06,21.59
N$15  (via drill 0.48)
  Top 0.254: RPI1.38 2.92,37.59 v4.19,36.32 | GPIO20.P$1 2.54,28.45 v4.06,26.92
  Bottom 0.254: v4.19,36.32 6.35,34.16 6.35,28.32 4.95,26.92 v4.06,26.92
N$16
  Top 0.254: U1.7 19.94,61.85 20.76,61.03 R14.1 SJ1.2
N$17
  Top 0.254: JP1.10 23.88,82.17 22.61,80.9 22.61,75.82 21.21,74.42 3.3,74.42 RPI1.10
N$18
  Top 0.254: JP1.8 21.34,81.91 20.07,80.64 20.07,75.95 19.56,75.44 9.4,75.44 8.38,76.96 4.32,76.96 3.05,75.69 RPI1.8
N$19
  Top 0.254: RPI1.40 GPIO21.P$1
RT_CS  (via drill 0.48, 0.5)
  Top 0.254: v45.97,48.01 43.94,48.01 43.69,48.26 43.69,49.34 R7.1 43.63,49.28 39.88,49.28 39.74,49.14 U2.5 | JP1.26 45.72,83.06 45.72,71.12 42.93,68.33 18.29,68.33 12.7,62.74 12.7,58.17 v11.3,56.77 8.64,54.1 3.3,54.1 RPI1.26
  Bottom 0.254: v45.97,48.01 45.97,51.56 41.4,56.13 11.94,56.13 v11.3,56.77
RT_INT  (via drill 0.48, 0.5)
  Top 0.254: U2.2 41.65,45.98 43.05,44.58 R8.2 43.37,44 43.94,43.43 v47.24,43.43 | JP1.18 34.04,82.17 32.77,80.9 32.77,73.02 31.11,71.37 16.76,71.37 12.7,67.31 v11.94,67.31 11.43,67.31 8.38,64.26 3.3,64.26 RPI1.18
  Bottom 0.254: v11.94,67.31 30.48,67.31 37.08,60.45 42.93,60.45 48.64,54.74 48.64,44.83 v47.24,43.43
SCLK  (via drill 0.48, 0.5)
  Top 0.254: U2.4 41.9,46.98 v42.67,47.75 | JP1.23 41.66,70.61 39.88,68.83 18.03,68.83 12.19,62.99 12.19,59.18 v8.89,55.88 8.13,55.37 RPI1.23 | R4.1 33.47,44.7 v36.07,44.7
  Bottom 0.254: v42.67,47.75 42.67,52.32 40.13,54.86 38.1,54.86 | v36.07,44.7 36.58,45.21 36.58,52.32 38.1,53.85 38.1,54.86 | 38.1,54.86 10.16,54.86 v8.89,55.88
TFT_CS  (via drill 0.48, 0.5)
  Top 0.254: X1.38 34.7,41.05 35.05,41.4 35.56,41.4 v36.32,42.16 | 26.92,55.37 26.54,55.75 26.54,61.59 27.69,62.74 36.83,62.74 38.86,64.77 v38.86,65.79 | 26.92,55.37 34.8,55.37 37.34,52.83 38.61,52.83 v39.62,53.85 | JP1.24 41.4,82.8 41.4,82.04 40.39,81.03 40.39,71.25 v39.05,69.91 38.48,69.34 17.78,69.34 11.68,63.25 11.68,59.44 9.65,57.4 9.14,57.4 8.38,56.64 3.3,56.64 RPI1.24 | 26.92,55.37 R5.1
  Bottom 0.254: v36.32,42.16 40.89,42.16 41.66,42.93 41.66,51.82 v39.62,53.85 | v38.86,65.79 38.86,69.72 v39.05,69.91
TFT_DC  (via drill 0.48, 0.5)
  Top 0.254: X1.37 34.2,41.56 v35.05,42.42 | JP1.22 39.12,81.79 37.85,80.52 37.85,71.25 36.96,70.36 17.27,70.36 10.67,63.75 10.67,61.47 v8.76,59.56 7.87,59.18 4.57,59.18 4.32,58.93 4.32,58.42 4.06,58.17 2.29,58.17 RPI1.22
  Bottom 0.254: v35.05,42.42 34.29,41.66 12.19,41.66 6.86,46.99 6.86,58.17 v8.76,59.56
TFT_RST
  Top 0.254: X1.10 20.7,34.8 21.34,34.16 47.5,34.16 50.35,37.02 IC5.2 50.5,40.96 R6.1
XL
  Top 0.254: X1.46 38.7,41.75 39.74,42.79 U2.16
XR
  Top 0.254: X1.44 37.7,41.8 37.08,42.42 37.08,43.69 37.59,44.2 38.1,44.2 38.24,44.34 U2.13
YD
  Top 0.254: U2.15 39.24,43.05 38.2,42.01 X1.45
YU
  Top 0.254: X1.47 39.2,41.48 40.49,42.77 U2.1

### Text on the board
tPlace: 1 | #18 PWM | STMPE610 + HX8357D | #21 | #26 | #19 | #20 | #13 | #16 | #6 | #12 | #5 | 3.5" 320x480 TFT / w/Touch Screen / for Raspberry Pi model B+